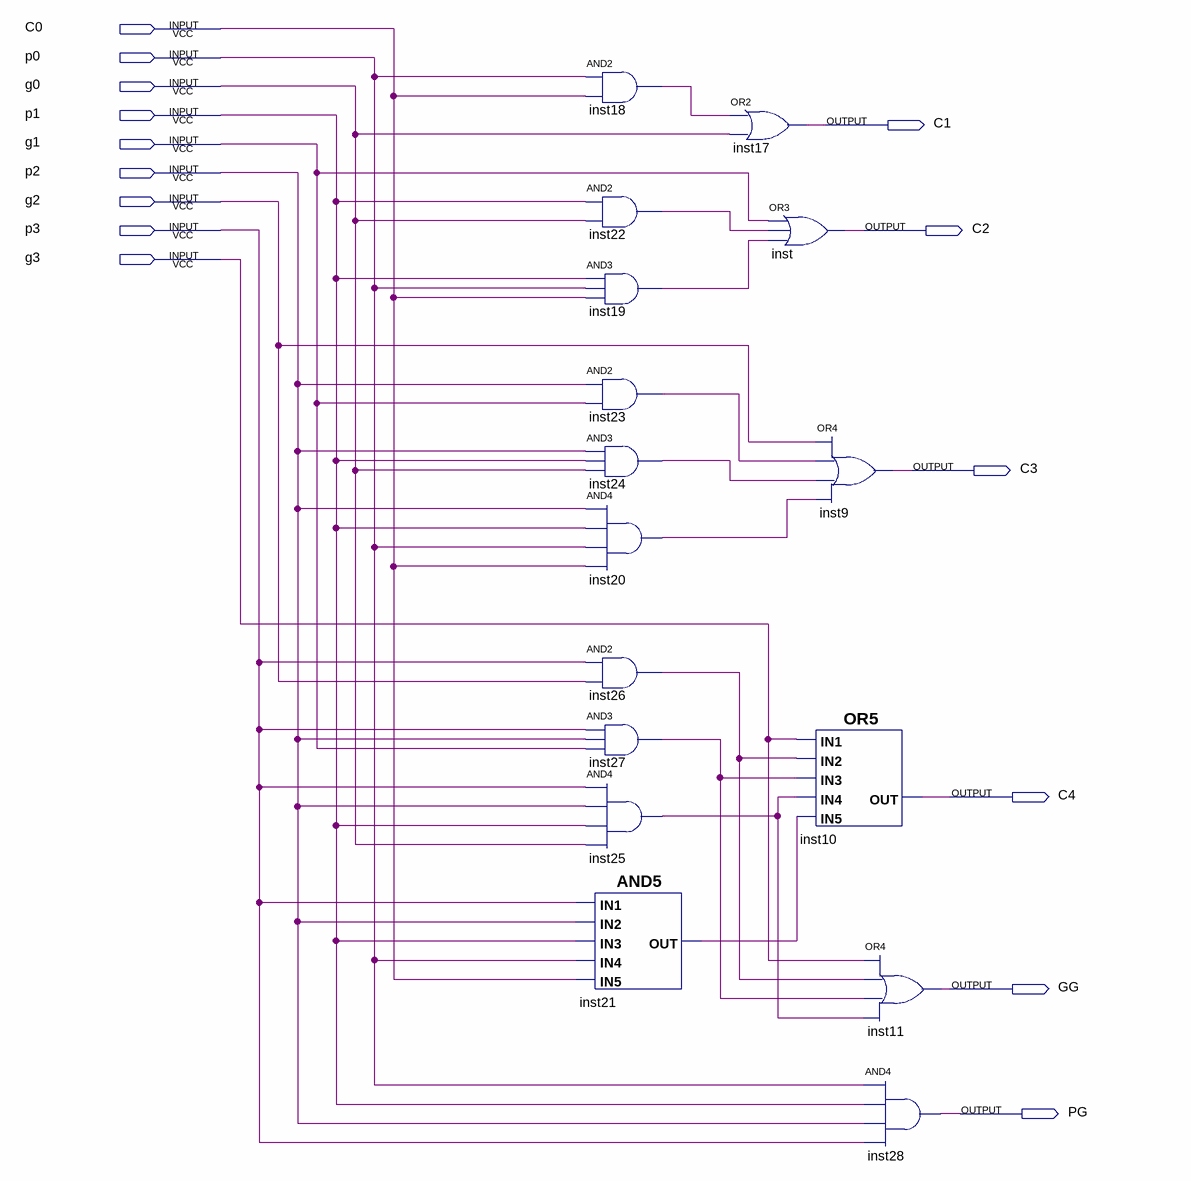
[diagram p0: schematic sheet]
// Quartus schematic Carry_Lookahead_Function.bdf as structural Verilog: 16 symbols, 15 pins
module Carry_Lookahead_Function (
  input  C0,
  input  p0,
  input  g0,
  input  p1,
  input  g1,
  input  p2,
  input  g2,
  input  p3,
  input  g3,
  output C1,
  output C2,
  output C3,
  output C4,
  output GG,
  output PG
);

  wire inst18_out, inst19_out, inst20_out, inst21_out, inst22_out, inst23_out, inst24_out, inst25_out,
       inst26_out, inst27_out;

  and inst18 (inst18_out, p0, C0);
  and inst22 (inst22_out, p1, g0);
  and inst19 (inst19_out, p1, p0, C0);
  and inst23 (inst23_out, p2, g1);
  and inst24 (inst24_out, p2, p1, g0);
  and inst20 (inst20_out, p2, p1, p0, C0);
  and inst26 (inst26_out, p3, g2);
  and inst27 (inst27_out, p3, p2, g1);
  and inst25 (inst25_out, p3, p2, p1, g0);
  and inst21 (inst21_out, p3, p2, p1, p0, C0);
  or inst17 (C1, inst18_out, g0);
  or inst (C2, g1, inst22_out, inst19_out);
  or inst9 (C3, g2, inst23_out, inst24_out, inst20_out);
  or inst10 (C4, g3, inst26_out, inst27_out, inst25_out, inst21_out);
  or inst11 (GG, g3, inst26_out, inst27_out, inst25_out);
  and inst28 (PG, p0, p1, p2, p3);
endmodule
